# EAGLE design SparkFun NEO-D9S (EAGLE 9.6.2)
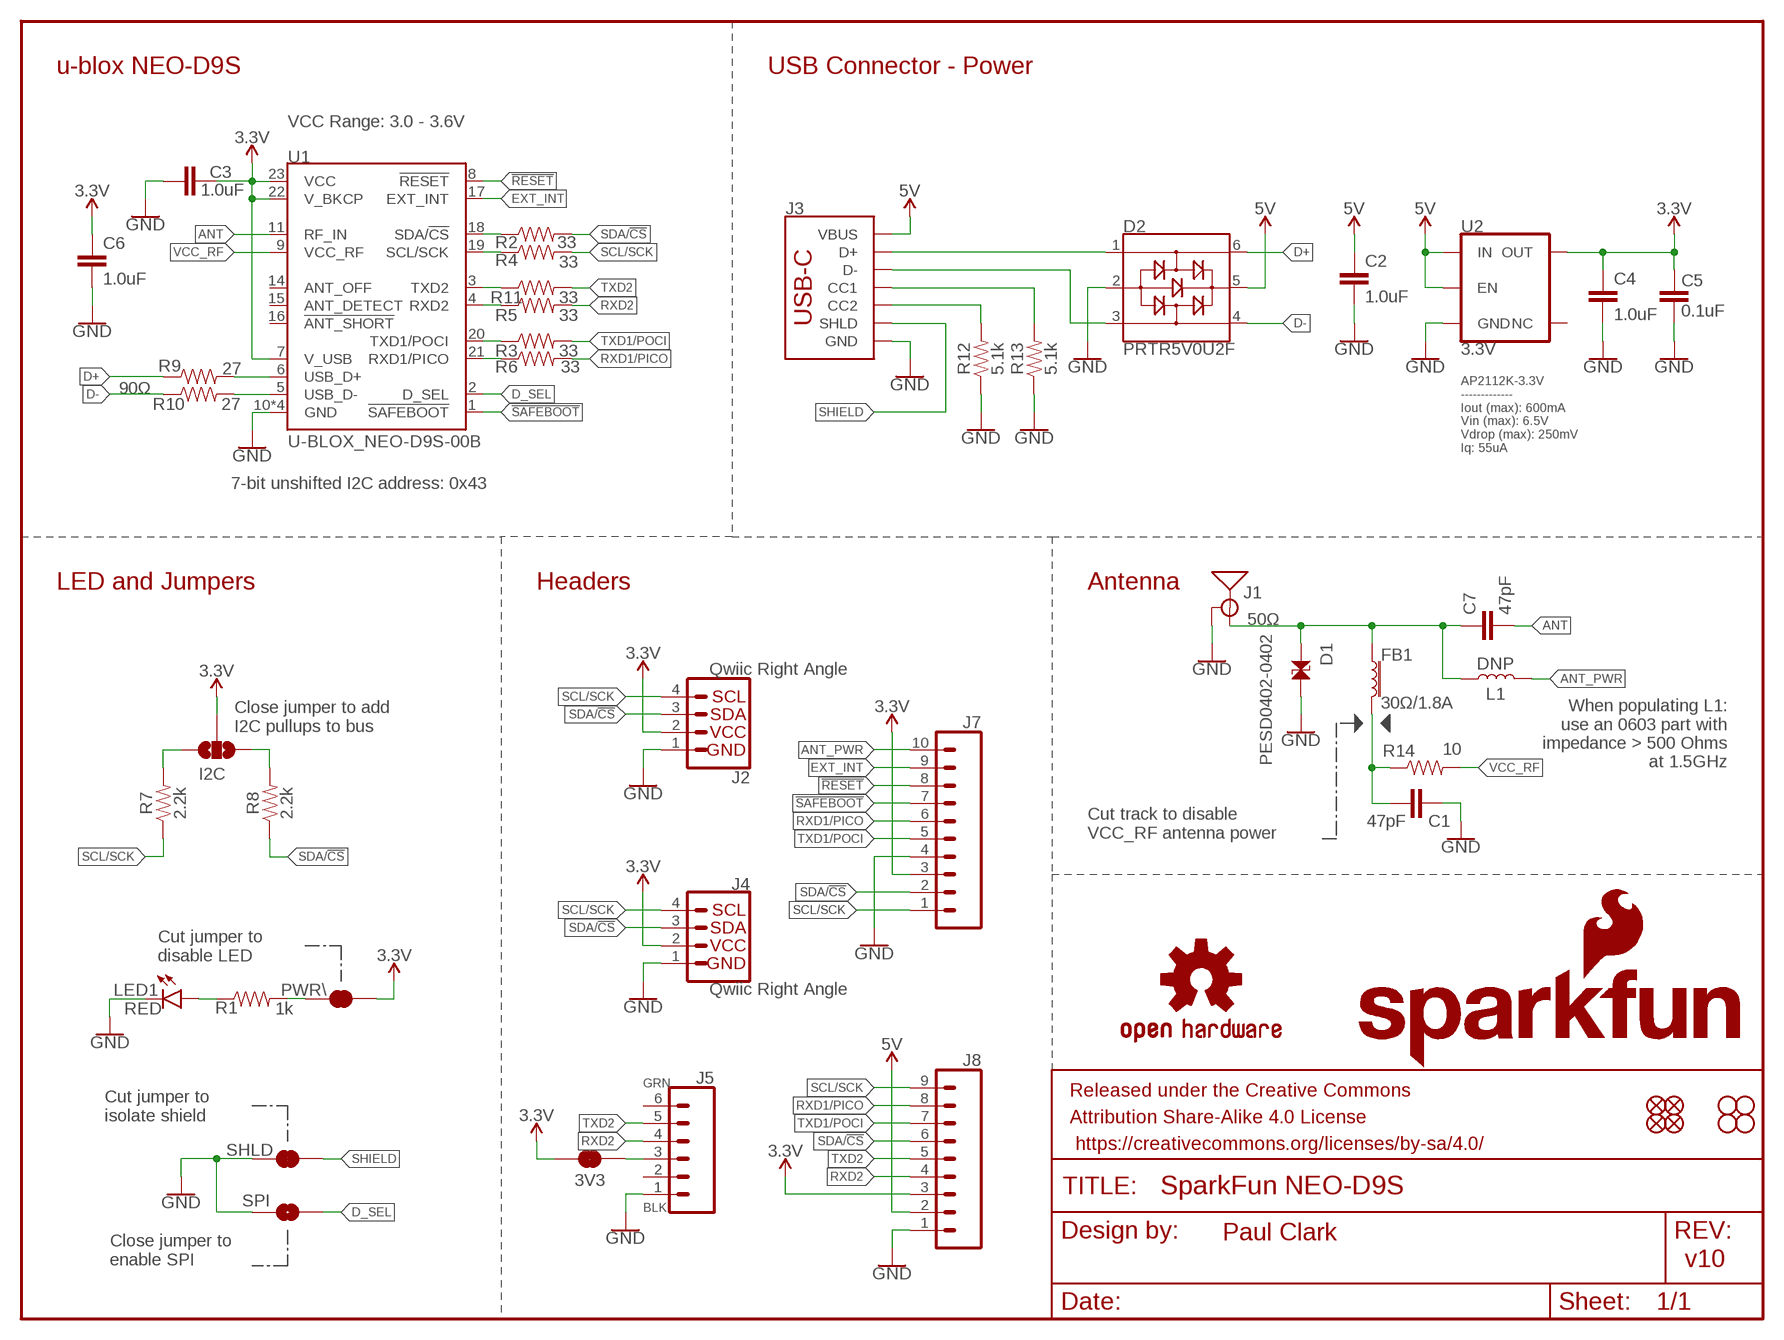
[diagram p0: schematic, sheet 1]

## Parts
3V3  JUMPER-SMT_2_NC_TRACE_SILK  [SMT-JUMPER_2_NC_TRACE_SILK]
C1  47pF  47PF-0603-50V-5%  [0603]
C2  1.0uF  1.0UF-0603-16V-10%  [0603]
C3  1.0uF  1.0UF-0603-16V-10%  [0603]
C4  1.0uF  1.0UF-0603-16V-10%  [0603]
C5  0.1uF  0.1UF-0603-25V-(+80/-20%)  [0603]
C6  1.0uF  1.0UF-0603-16V-10%  [0603]
C7  47pF  47PF-0603-50V-5%  [0603]
D1  PESD0402-0402  [0402]
D2  PRTR5V0U2F  [SOT886]
FB1  30Ω/1.8A  FERRITE_BEAD-0603  [0603]
FRAME1  FRAME-LETTER  [CREATIVE_COMMONS]
I2C  JUMPER-SMT_3_NO_SILK  [SMT-JUMPER_3_NO_SILK]
J1  ANTENNA-SMA-GROUNDEDEDGE_SMA  [SMA-EDGE]
J2  Qwiic Right Angle  I2C_STANDARDQWIIC  [JST04_1MM_RA]
J3  USB_C_2-LAYER_PADS  [USB-C-16P-2LAYER-PADS]
J4  Qwiic Right Angle  I2C_STANDARDQWIIC  [JST04_1MM_RA]
J5  CONN_06NO_SILK_FEMALE_PTH  [1X06_NO_SILK]
J7  CONN_10NO_SILK_PTH_FEMALE  [1X10_NO_SILK]
J8  CONN_09NO_SILK  [1X09_NO_SILK]
JP21  FIDUCIALUFIDUCIAL  [MICRO-FIDUCIAL]
JP31  STAND-OFF  [STAND-OFF]
JP41  STAND-OFF  [STAND-OFF]
JP61  FIDUCIALUFIDUCIAL  [MICRO-FIDUCIAL]
JP71  FIDUCIALUFIDUCIAL  [MICRO-FIDUCIAL]
JP81  FIDUCIALUFIDUCIAL  [MICRO-FIDUCIAL]
JP91  STAND-OFF  [STAND-OFF]
JP101  STAND-OFF  [STAND-OFF]
L1  DNP  DNP-0603_NO-CREAM  [0603_NO-CREAM]
LED1  RED  LED-RED0603  [LED-0603]
LOGO1  OSHW-LOGOS  [OSHW-LOGO-S]
LOGO2  SFE_LOGO_NAME_FLAME.1_INCH  [SFE_LOGO_NAME_FLAME_.1]
LOGO3  SFE_LOGO_NAME_FLAME.1_INCH  [SFE_LOGO_NAME_FLAME_.1]
LOGO4  OSHW-LOGOS  [OSHW-LOGO-S]
PWR\  JUMPER-SMT_2_NC_TRACE_SILK  [SMT-JUMPER_2_NC_TRACE_SILK]
R1  1k  1KOHM-0603-1/10W-1%  [0603]
R2  33  33OHM-0603-1/10W-1%  [0603]
R3  33  33OHM-0603-1/10W-1%  [0603]
R4  33  33OHM-0603-1/10W-1%  [0603]
R5  33  33OHM-0603-1/10W-1%  [0603]
R6  33  33OHM-0603-1/10W-1%  [0603]
R7  2.2k  2.2KOHM-0603-1/10W-1%  [0603]
R8  2.2k  2.2KOHM-0603-1/10W-1%  [0603]
R9  27  27OHM-0603-1/10W-1%  [0603]
R10  27  27OHM-0603-1/10W-1%  [0603]
R11  33  33OHM-0603-1/10W-1%  [0603]
R12  5.1k  5.1KOHM5.1KOHM-0603-1/10W-1%  [0603]
R13  5.1k  5.1KOHM5.1KOHM-0603-1/10W-1%  [0603]
R14  10  10OHM-0603-1/10W-1%  [0603]
SHLD  JUMPER-SMT_2_NC_TRACE_SILK  [SMT-JUMPER_2_NC_TRACE_SILK]
SPI  JUMPER-SMT_2_NO_SILK  [SMT-JUMPER_2_NO_SILK]
U1  U-BLOX_NEO-D9S-00B  [NEO-M9N/M8T/M8U/D9S]
U2  3.3V  V_REG_AP2112K-3.3V  [SOT23-5]

## Nets
3.3V [3.3V]: 3V3.2 C3.1 C4.1 C5.2 C6.1 I2C.2 J2.2 J4.2 J7.3 J8.3 PWR\.2 U1.7(V_USB) U1.22(V_BKCP) U1.23(VCC) U2.5(OUT)
5V: C2.1 D2.5 J3.VBUS1(VBUS) J3.VBUS2(VBUS) J8.2 U2.1(IN) U2.3(EN)
!RESET!: J7.8 U1.8(!RESET!)
!SAFEBOOT!: J7.7 U1.1(!SAFEBOOT!)
ANT: C7.2 U1.11(RF_IN)
ANT_PWR: J7.10 L1.2
ANT_VCC: C1.1 FB1.2 R14.1
D+: D2.6 R9.1
D-: D2.4 R10.1
D_SEL: SPI.2 U1.2(D_SEL)
EXT_INT: J7.9 U1.17(EXT_INT)
GND: C1.2 C2.2 C3.2 C4.2 C5.1 C6.2 D1.2 D2.2 J1.GND@0(GND) J1.GND@1(GND) J1.GND@2(GND) J1.GND@3(GND) J2.1 J3.GND J3.GND2(GND) J4.1 J5.1 J7.4 J8.1 LED1.C R12.1 R13.1 SHLD.1 SPI.1 U1.10(GND) U1.12(GND) U1.13(GND) U1.24(GND) U2.2(GND)
N$1: PWR\.1 R1.2
N$2: R3.1 U1.20(TXD1/POCI)
N$3: R2.1 U1.18(SDA/!CS!)
N$4: R4.1 U1.19(SCL/SCK)
N$5: I2C.1 R8.2
N$6: R6.1 U1.21(RXD1/PICO)
N$7: J3.B5(CC2) R12.2
N$8: I2C.3 R7.2
N$9: J3.A5(CC1) R13.2
N$10: LED1.A R1.1
N$11: R9.2 U1.6(USB_D+)
N$12: R10.2 U1.5(USB_D-)
N$13: 3V3.1 J5.3
N$14: R11.1 U1.3(TXD2)
N$15: R5.1 U1.4(RXD2)
RXD1/PICO: J7.6 J8.8 R6.2
RXD2: J5.4 J8.4 R5.2
SCL/SCK: J2.4 J4.4 J7.1 J8.9 R4.2 R7.1
SDA/!CS!: J2.3 J4.3 J7.2 J8.6 R2.2 R8.1
SHIELD: J3.SHLD1(SHLD) J3.SHLD2(SHLD) J3.SHLD3(SHLD) J3.SHLD4(SHLD) SHLD.2
SMA: C7.1 D1.1 FB1.1 J1.SIG(SIGNAL) L1.1
TXD1/POCI: J7.5 J8.7 R3.2
TXD2: J5.5 J8.5 R11.2
USB_D+: D2.1 J3.A6(D+) J3.B6(D+)
USB_D-: D2.3 J3.A7(D-) J3.B7(D-)
VCC_RF: R14.2 U1.9(VCC_RF)
Unconnected: J5.2 J5.6 U1.14(ANT_OFF) U1.15(ANT_DETECT) U1.16(!ANT_SHORT!) U2.4(NC)

## Notes on the sheet
- u-blox NEO-D9S | USB Connector - Power
- VCC Range: 3.0 - 3.6V
- AP2112K-3.3V
  -------------
  Iout (max): 600mA 
  Vin (max): 6.5V
  Vdrop (max): 250mV
  Iq: 55uA
- 90Ω
- 7-bit unshifted I2C address: 0x43
- LED and Jumpers | Headers | Antenna
- 50Ω
- Close jumper to add
  I2C pullups to bus
- When populating L1:
  use an 0603 part with
  impedance > 500 Ohms
  at 1.5GHz
- Cut track to disable
  VCC_RF antenna power
- Cut jumper to 
  disable LED
- GRN
- Cut jumper to 
  isolate shield
- BLK
- Paul Clark
- Close jumper to
  enable SPI
- v10

## Library data of the parts
3V3 PWR\ SHLD = SparkFun-Jumpers:JUMPER-SMT_2_NC_TRACE: Normally closed trace jumper This jumper has a trace between two pads so it's normally closed (NC). Use a razor knife to open the connection. For best results follow the IPC guidelines for cutting traces: Cutout at least 0.063 mm (0.005 in). Remove all loose material to clean up the cut area. Seal the cut with an approved epoxy. Reapply solder to reclose the connection.
C1 C7 = SparkFun-Capacitors:47PF: 47pF ceramic capacitors A capacitor is a passive two-terminal electrical component used to store electrical energy temporarily in an electric field.; PROD_ID: CAP-08913
C2-C4 C6 = SparkFun-Capacitors:1.0UF: 1µF ceramic capacitors A capacitor is a passive two-terminal electrical component used to store electrical energy temporarily in an electric field.; PROD_ID: CAP-00868
C5 = SparkFun-Capacitors:0.1UF: 0.1µF ceramic capacitors A capacitor is a passive two-terminal electrical component used to store electrical energy temporarily in an electric field.; PROD_ID: CAP-00810
D1 = SparkFun-DiscreteSemi:PESD0402: ESD protection diode PESD is used to protect a signal line from ESD.; DIGIKEY_PART: PESD0402-140CT-ND; MOUSE_PART: 650-PESD0402-140; PROD_ID: DIO-15359
D2 = SparkFun-IC-Power:PRTR5V0U2: A small ESD protection device. Most commonly used on USB D+/D- signals to protect large, expensive, or especially sensitive USB enabled devices.; PROD_ID: DIO-14084
FB1 = SparkFun-Coils:FERRITE_BEAD: Ferrite Bead (blocks, cores, rings, chokes, etc.) Inductor with layers of ferrite used to suppress high frequencies. Often used to isolate high frequency noise. SparkFun Products: IOIO-OTG - V2.2 <https://www.sparkfun.com/products/13613> SparkFun SAMD21 Mini Breakout <https://www.sparkfun.com/products/13664> SparkFun 6 Degrees of Freedom Breakout - LSM6DS3 <https://www.sparkfun.com/products/13339> SparkFun SAMD21 Dev Breakout <https://www.sparkfun.com/products/13672>; PROD_ID: NDUC-13805
FRAME1 = SparkFun-Aesthetics:FRAME-LETTER: Schematic Frame - Letter Standard 8.5x11 US Letter frame
I2C = SparkFun-Jumpers:JUMPER-SMT_3_NO: Normally open jumper This jumper has three pads in close proximity to each other. Apply solder to close the connection(s).
J1 = SparkFun-RF:ANTENNA-SMA-GROUNDED: SMA Antenna Connector w/ Ground Edge-mount and SMD SMA connectors for RF Antennas. **4-LAYER BOARD WARNING!!** When designing a 4-layer board using any of the SMD variants, you will need to manually add a cutout polygon on any internal power layers to make sure that you don't end up with exposed copper around the edge of the routed hole for these connectors. Exposed power copper could then short to the connector body - and that would be bad. Why hasn't anyone added the cutout polygons directly to the connector footprint? Well, your internal layers (usually 2 and 15) may be covered with GND polygons and you might well want the copper to go all the way to the edge, especially under the connector SIGNAL pin. So adding cutouts to the footprint might make matters worse, not better...; PROD_ID: CONN-08289
J2 J4 = SparkFun-Connectors:I2C_STANDARD: SparkFun I2C Standard Pinout Header SparkFun has standardized on a pinout for all I2C based sensor breakouts. This pinout allows I2C boards to be plugged directly into the headers on Arduino Uno compatible boards, and to be daisy chained easily. Example SparkFun Products: SparkFun Atmospheric Sensor Breakout - BME280 <https://www.sparkfun.com/products/13676> SparkFun Altitude/Pressure Sensor Breakout - MPL3115A2 <https://www.sparkfun.com/products/11084> SparkFun TOF Range Finder Sensor - VL6180 <https://www.sparkfun.com/products/12785>; PROD_ID: CONN-13694
J3 = SparkFun-Connectors:USB_C: USB Type C 16Pin Connector Super Speed pins not available on the 16-pin purely SMD connector so this part is best for USB 2.0 implementations. D1 and D2 are tied together enabling D+/- no matter which way the cable is plugged into the connector. The two channel configuration pins (CC1/2) are exposed. These are normally connected to ground via 5.1k resistors but can be reconfigured for high current/high power applications. **4-LAYER BOARD WARNING!!** If designing 4-layer board, make sure to select the variant _4-LAYER-ISOLATED. The linked footprint (USB-C-16-4LAYER-ISOLATED) includes some very necessary cutout polygons in the inner layers (2 and 15). This prevents the PTH mounting shield legs on the USB connector from electrically connecting any other polygons on the inner layers (usually VCC and GND).; PROD_ID: CONN-14122
J5 = SparkFun-Connectors:CONN_06: Multi connection point. Often used as Generic Header-pin footprint for 0.1 inch spaced/style header connections On any of the 0.1 inch spaced packages, you can populate with these: Break Away Headers - Straight <https://www.sparkfun.com/products/116> (PRT-00116) Break Away Male Headers - Right Angle <https://www.sparkfun.com/products/553> (PRT-00553) Female Headers <https://www.sparkfun.com/products/115> (PRT-00115) Break Away Headers - Machine Pin <https://www.sparkfun.com/products/117> (PRT-00117) Break Away Female Headers - Swiss Machine Pin <https://www.sparkfun.com/products/743> (PRT-00743) Arduino Stackable Header - 6 Pin <https://www.sparkfun.com/products/9280> (PRT-09280) For SCREWTERMINALS and SPRING TERMINALS visit here: Screw Terimnals on SparkFun.com <https://www.sparkfun.com/search/results?term=Screw+Terminals> (5mm/3.5mm/2.54mm spacing) This device is also useful as a general connection point to wire up your design to another part of your project. Our various solder wires solder well into these plated through hole pads. Hook-Up Wire - Assortment (Stranded, 22 AWG) <https://www.sparkfun.com/products/11375> (PRT-11375) Hook-Up Wire - Assortment (Solid Core, 22 AWG) <https://www.sparkfun.com/products/11367> (PRT-11367) View the entire wire category on our website here <https://www.sparkfun.com/categories/141>; PROD_ID: CONN-08437
J7 = SparkFun-Connectors:CONN_10: Multi connection point. Often used as Generic Header-pin footprint for 0.1 inch spaced/style header connections On any of the 0.1 inch spaced packages, you can populate with these: Break Away Headers - Straight <https://www.sparkfun.com/products/116> (PRT-00116) Break Away Male Headers - Right Angle <https://www.sparkfun.com/products/553> (PRT-00553) Female Headers <https://www.sparkfun.com/products/115> (PRT-00115) Break Away Headers - Machine Pin <https://www.sparkfun.com/products/117> (PRT-00117) Break Away Female Headers - Swiss Machine Pin <https://www.sparkfun.com/products/743> (PRT-00743) Arduino Stackable Header - 10 Pin <https://www.sparkfun.com/products/11376> (PRT-11376) For SCREWTERMINALS and SPRING TERMINALS visit here: Screw Terimnals on SparkFun.com <https://www.sparkfun.com/search/results?term=Screw+Terminals> (5mm/3.5mm/2.54mm spacing) This device is also useful as a general connection point to wire up your design to another part of your project. Our various solder wires solder well into these plated through hole pads. Hook-Up Wire - Assortment (Stranded, 22 AWG) <https://www.sparkfun.com/products/11375> (PRT-11375) Hook-Up Wire - Assortment (Solid Core, 22 AWG) <https://www.sparkfun.com/products/11367> (PRT-11367) View the entire wire category on our website here <https://www.sparkfun.com/categories/141> Special notes: Molex polarized connector foot print use with SKU : PRT-08231 with associated crimp pins and housings. 1MM SMD Version SKU: PRT-10208 NOTES ON THE VARIANTS LOCK and LOCK_LONGPADS... This footprint was designed to help hold the alignment of a through-hole component (i.e. 6-pin header) while soldering it into place. You may notice that each hole has been shifted either up or down by 0.005 of an inch from it's more standard position (which is a perfectly straight line). This slight alteration caused the pins (the squares in the middle) to touch the edges of the holes. Because they are alternating, it causes a "brace" to hold the component in place. 0.005 has proven to be the perfect amount of "off-center" position when using our standard breakaway headers. Although looks a little odd when you look at the bare footprint, once you have a header in there, the alteration is very hard to notice. Also,if you push a header all the way into place, it is covered up entirely on the bottom side.
J8 = SparkFun-Connectors:CONN_09: Multi connection point. Often used as Generic Header-pin footprint for 0.1 inch spaced/style header connections On any of the 0.1 inch spaced packages, you can populate with these: Break Away Headers - Straight <https://www.sparkfun.com/products/116> (PRT-00116) Break Away Male Headers - Right Angle <https://www.sparkfun.com/products/553> (PRT-00553) Female Headers <https://www.sparkfun.com/products/115> (PRT-00115) Break Away Headers - Machine Pin <https://www.sparkfun.com/products/117> (PRT-00117) Break Away Female Headers - Swiss Machine Pin <https://www.sparkfun.com/products/743> (PRT-00743) For SCREWTERMINALS and SPRING TERMINALS visit here: Screw Terimnals on SparkFun.com <https://www.sparkfun.com/search/results?term=Screw+Terminals> (5mm/3.5mm/2.54mm spacing) This device is also useful as a general connection point to wire up your design to another part of your project. Our various solder wires solder well into these plated through hole pads. Hook-Up Wire - Assortment (Stranded, 22 AWG) <https://www.sparkfun.com/products/11375> (PRT-11375) Hook-Up Wire - Assortment (Solid Core, 22 AWG) <https://www.sparkfun.com/products/11367> (PRT-11367) View the entire wire category on our website here <https://www.sparkfun.com/categories/141> Special notes: Molex polarized connector foot print use with SKU : PRT-08231 with associated crimp pins and housings. 1MM SMD Version SKU: PRT-10208 NOTES ON THE VARIANTS LOCK and LOCK_LONGPADS... This footprint was designed to help hold the alignment of a through-hole component (i.e. 6-pin header) while soldering it into place. You may notice that each hole has been shifted either up or down by 0.005 of an inch from it's more standard position (which is a perfectly straight line). This slight alteration caused the pins (the squares in the middle) to touch the edges of the holes. Because they are alternating, it causes a "brace" to hold the component in place. 0.005 has proven to be the perfect amount of "off-center" position when using our standard breakaway headers. Although looks a little odd when you look at the bare footprint, once you have a header in there, the alteration is very hard to notice. Also,if you push a header all the way into place, it is covered up entirely on the bottom side.
JP21 JP61 JP71 JP81 = SparkFun:FIDUCIAL: Fiducial Alignment Points Various fiducial points for machine vision alignment.
JP31 JP41 JP91 JP101 = SparkFun:STAND-OFF: Stand Off This is the mechanical footprint for a #4 phillips button head screw. Use the keepout ring to avoid running the screw head into surrounding components. SKU : PRT-00447
L1 = SparkFun-Coils:DNP
LED1 = SparkFun-LED:LED-RED: Red SMD LED Used in manufacturing of most products at SparkFun Packages: 0603 - SMD 0603 package [Product Link] <http://docs.avagotech.com/docs/AV02-0551EN> 0603 SMART - SMD 0603 SMART package ( more efficient and expensive)[Product Link] <http://www.osram-os.com/Graphics/XPic2/00077099_0.pdf> 1206 - SMD1206 package [Product Link] <https://www.sparkfun.com/datasheets/DevTools/LilyPad/Q150OVS4.pdff> SparkFun Products: Pro Mini 328 -5V <https://www.sparkfun.com/products/821> RedBoard <https://www.sparkfun.com/products/12757> IOIO-OTG <https://www.sparkfun.com/products/13613>; PROD_ID: DIO-00819
LOGO1 LOGO4 = SparkFun-Aesthetics:OSHW-LOGO: Open-Source Hardware (OSHW) Logo This logo indicates the piece of hardware it is found on incorporates a OSHW license and/or adheres to the definition of open source hardware found here: http://freedomdefined.org/OSHW
LOGO2 LOGO3 = SparkFun-Aesthetics:SFE_LOGO_NAME_FLAME: SparkFun Font Logo w/ Flame This is the SparkFun full logo. The logo on the schematic will always be the same size; the package variant is the height of the flame part of the logo. Default layer for the logo on the board is tSilk.
R1 = SparkFun-Resistors:1KOHM: 1kΩ resistor A resistor is a passive two-terminal electrical component that implements electrical resistance as a circuit element. Resistors act to reduce current flow, and, at the same time, act to lower voltage levels within circuits. - Wikipedia; PROD_ID: RES-07856
R2-R6 R11 = SparkFun-Resistors:33OHM: 33Ω resistor A resistor is a passive two-terminal electrical component that implements electrical resistance as a circuit element. Resistors act to reduce current flow, and, at the same time, act to lower voltage levels within circuits. - Wikipedia; PROD_ID: RES-08270
R7 R8 = SparkFun-Resistors:2.2KOHM: 2.2kΩ resistor A resistor is a passive two-terminal electrical component that implements electrical resistance as a circuit element. Resistors act to reduce current flow, and, at the same time, act to lower voltage levels within circuits. - Wikipedia; PROD_ID: RES-08272
R9 R10 = SparkFun-Resistors:27OHM: 27Ω resistor A resistor is a passive two-terminal electrical component that implements electrical resistance as a circuit element. Resistors act to reduce current flow, and, at the same time, act to lower voltage levels within circuits. - Wikipedia; PROD_ID: RES-09334
R12 R13 = SparkFun-Resistors:5.1KOHM; PROD_ID: RES-12083
R14 = SparkFun-Resistors:10OHM: 10Ω resistor A resistor is a passive two-terminal electrical component that implements electrical resistance as a circuit element. Resistors act to reduce current flow, and, at the same time, act to lower voltage levels within circuits. - Wikipedia; PROD_ID: RES-12581
SPI = SparkFun-Jumpers:JUMPER-SMT_2_NO: Normally open jumper This jumper has two pads in close proximity to each other. Apply solder to close the connection. Round pads are easier to solder for beginners, but are a lot larger. SparkFun Product that uses the round pads: SparkFun EL Sequencer <https://www.sparkfun.com/products/12781>
U1 = SparkFun-GPS:U-BLOX_NEO-D9S: u-blox NEO-D9S The NEO-D9S can receive the data stream of a GNSS correction service, broadcast via satellite L band and compliant to the specification the product is designed for. Integrated with a high precision GNSS receiver, such as from the u-blox F9 platform, it enables the positioning system to reach down to centimeter-level accuracy.; PROD_ID: IC-16579
U2 = SparkFun-IC-Power:V_REG_AP2112: AP2112 - 600mA CMOS LDO Regulator w/ Enable The AP2112 is CMOS process low dropout linear regulator with enable function, the regulator delivers a guaranteed 600mA (min.) continuous load current. Features Output Voltage Accuracy: ±1.5% Output Current: 600mA (Min.) Foldback Short Current Protection: 50mA Enable Function to Turn ON/OFF VOUT Low Dropout Voltage (3.3V): 250mV (Typ.) @IOUT=600mA Excellent Load Regulation: 0.2%/A (Typ.) Excellent Line Regulation: 0.02%/V (Typ.) Low Quiescent Current: 55μA (Typ.) Low Standby Current: 0.01μA (Typ.) Low Output Noise: 50μVRMS PSRR: 100Hz -65dB, 1kHz -65dB OTSD Protection Stable with 1.0μF Flexible Cap: Ceramic, Tantalum and Aluminum Electrolytic Operation Temperature Range: -40°C to 85°C ESD: MM 400V, HBM 4000V; PROD_ID: VREG-12457

## Net classes
1 vcc: width 0.152 mm
2 3.3V: width 0.508 mm

## Board
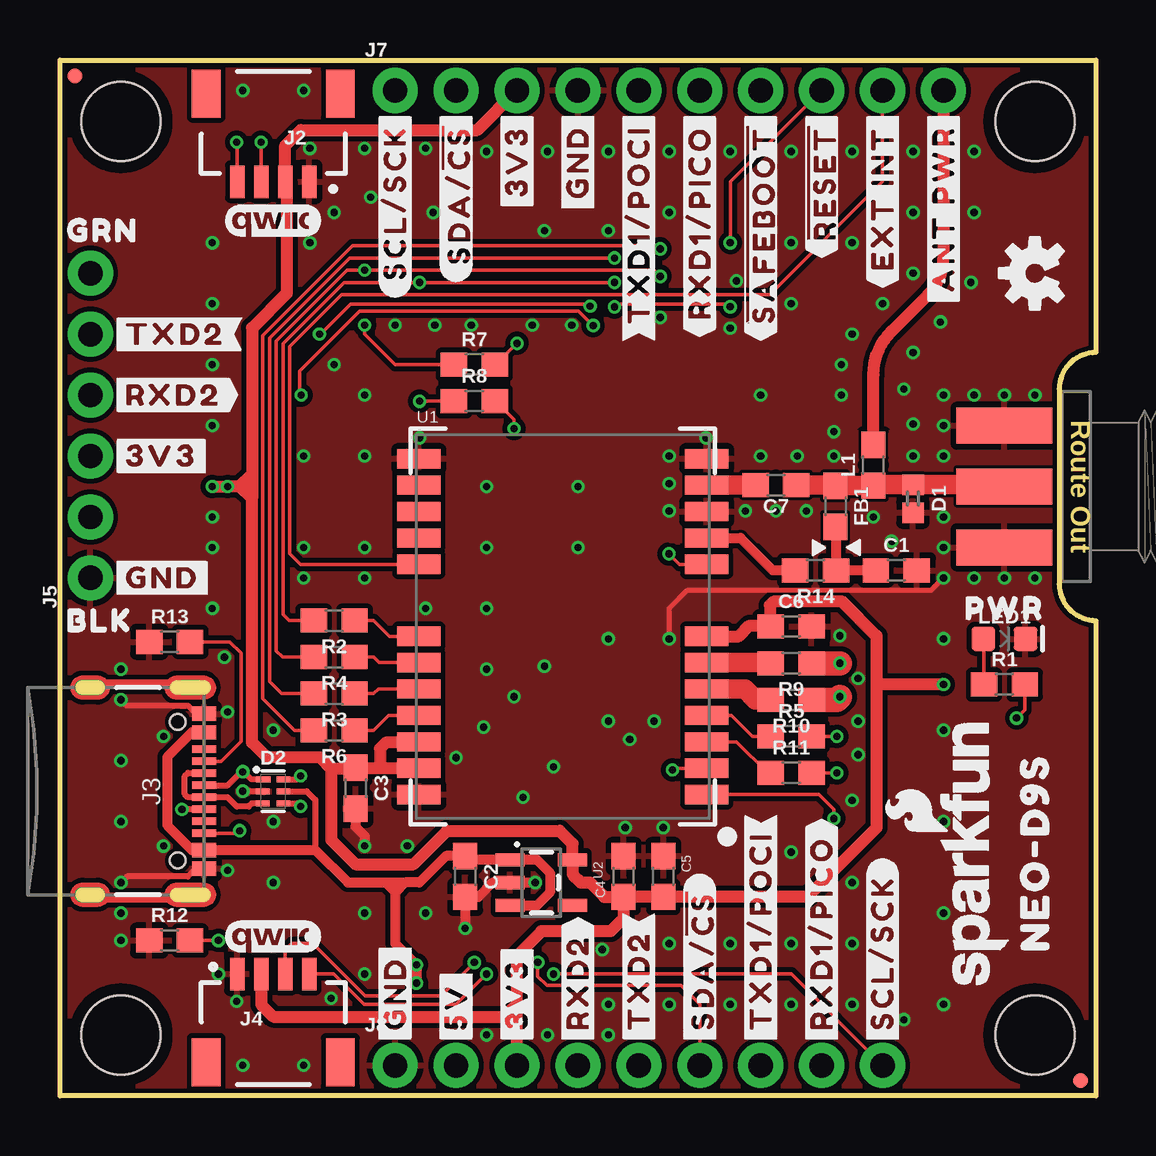
[diagram p1: board, top side]
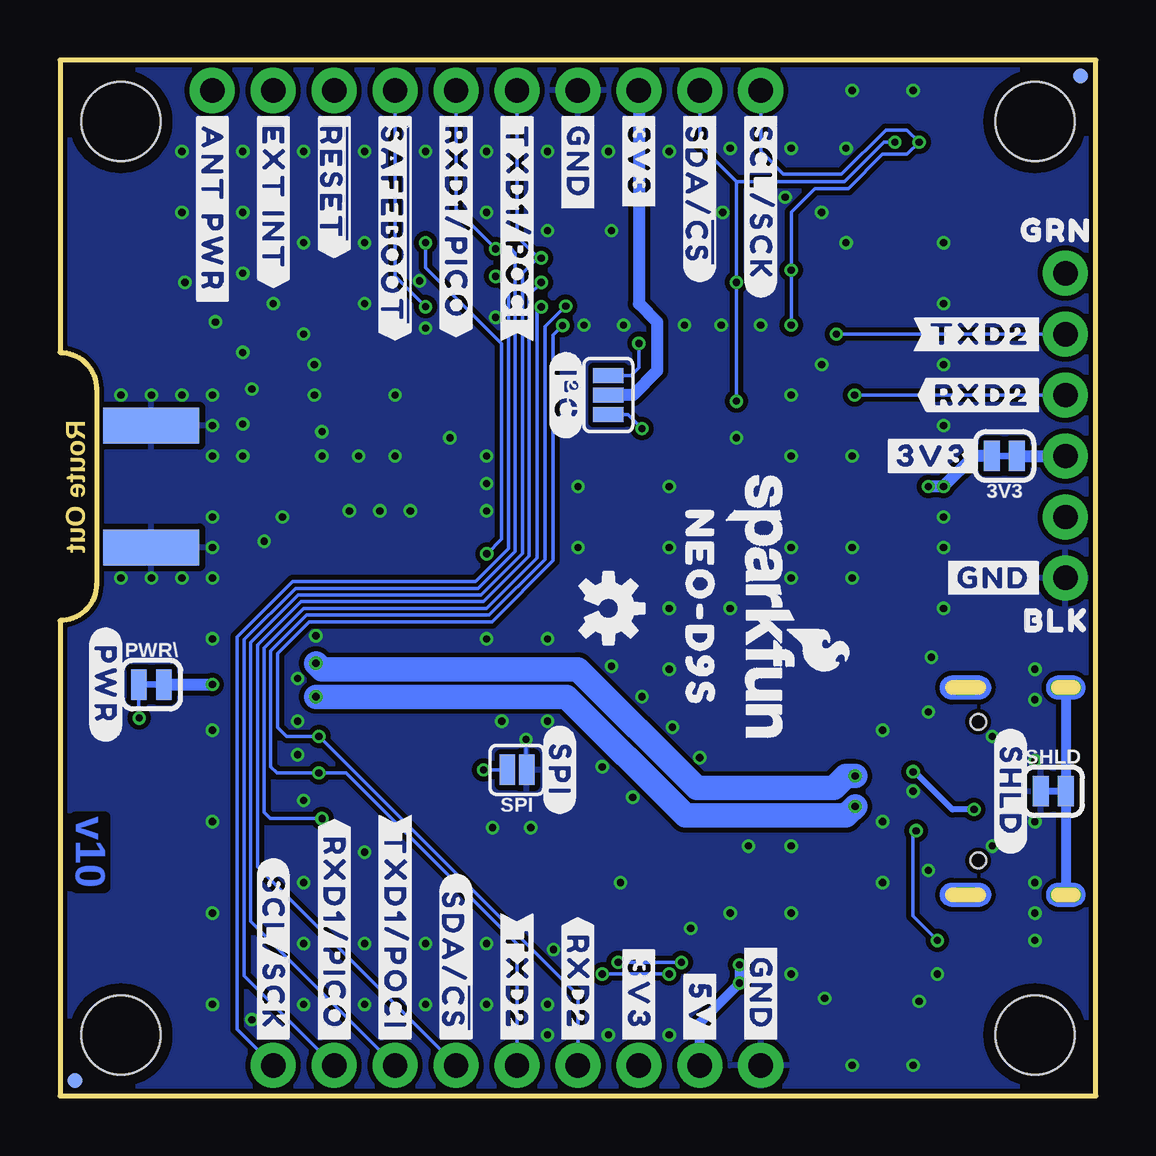
[diagram p2: board, bottom side, seen from below]

Size 43.18 x 43.18 mm. Coordinates in mm from the lower left corner, seen from the top.
Outline: 0,0 0,43.18 43.18,43.18 43.18,30.99 arc90 41.66,29.46 41.66,21.34 arc90 43.18,19.81 43.18,0 0,0
Copper layers (1*16): Top 0.035mm / dielectric 1.5mm / Bottom 0.035mm
Design rules "SparkFun-2-Layer-Minimum-JLCPCB": minimum track width 5mil, minimum drill 0.3mm, track to track 5mil, track to pad 5mil, pad to pad 5mil, via to via 5mil, smd to smd 5mil, copper to edge 7mil, drill to drill 7mil, minimum pad ring 5mil, minimum via ring 5mil, stop-mask expansion 2.5mil, vias tented up to drill 25mil, thermal gap 10mil
tRestrict: 2 lines

### Footprints (pad centres in the part's own frame; a part is rotated, then mirrored left to right if it is on the bottom)
SMT-JUMPER_2_NC_TRACE_SILK = smd 0.66 x 1.27: 1 -0.521,0; 2 0.521,0
0603 = smd 1.1 x 1: 1 -0.85,0; 2 0.85,0
0402 = smd 0.85 x 0.9: 1 -0.58,0; 2 0.58,0
SOT886 = smd 0.61 x 0.25: 1 -0.405,0.5 | smd 0.56 x 0.25: 2 -0.43,0; 3 -0.43,-0.5; 4 0.43,-0.5; 5 0.43,0; 6 0.43,0.5
SMT-JUMPER_3_NO_SILK = smd 0.635 x 1.27: 1 -0.813,0; 2 0,0; 3 0.813,0
SMA-EDGE = smd 1.5 x 4: GND@0 -2.54,0; GND@1 2.54,0; SIG 0,0 | smd 1.5 x 4 bottom: GND@2 -2.54,0; GND@3 2.54,0
JST04_1MM_RA = smd 0.6 x 1.35: 1 -1.5,0; 2 -0.5,0; 3 0.5,0; 4 1.5,0 | smd 1.2 x 2: NC1 2.8,-3.675; NC2 -2.8,-3.675
USB-C-16P-2LAYER-PADS = smd 0.3 x 1: A5 -1.25,-0.34; A6 -0.25,-0.34; A7 0.25,-0.34; A8 1.25,-0.34; B5 1.75,-0.34; B6 0.75,-0.34; B7 -0.75,-0.34; B8 -1.75,-0.34 | smd 0.6 x 1: GND -3.225,-0.34; GND2 3.225,-0.34; VBUS1 -2.45,-0.34; VBUS2 2.45,-0.34 | drill 0.4 pad 0.6 long: SHLD1 -4.318,-0.915; SHLD2 4.318,-0.915; SHLD3 -4.318,-5.095; SHLD4 4.318,-5.095 | hole 0.65: -2.89,-1.445; 2.89,-1.445
1X06_NO_SILK = drill 1.016 pad 1.88: 1 0,0; 2 2.54,0; 3 5.08,0; 4 7.62,0; 5 10.16,0; 6 12.7,0
1X10_NO_SILK = drill 1.016 pad 1.88: 1 0,0; 2 2.54,0; 3 5.08,0; 4 7.62,0; 5 10.16,0; 6 12.7,0; 7 15.24,0; 8 17.78,0; 9 20.32,0; 10 22.86,0
1X09_NO_SILK = drill 1.016 pad 1.88: 1 0,0; 2 2.54,0; 3 5.08,0; 4 7.62,0; 5 10.16,0; 6 12.7,0; 7 15.24,0; 8 17.78,0; 9 20.32,0
MICRO-FIDUCIAL = smd 0.635 x 0.635: 1 0,0
STAND-OFF = hole 3.302: 0,0
0603_NO-CREAM = smd 1.1 x 1: 1 -0.85,0; 2 0.85,0
LED-0603 = smd 1 x 1: A -0.877,0; C 0.877,0
SMT-JUMPER_2_NO_SILK = smd 0.635 x 1.27: 1 -0.406,0; 2 0.406,0
NEO-M9N/M8T/M8U/D9S = smd 1.8 x 0.8: 1 6,-7; 2 6,-5.9; 3 6,-4.8; 4 6,-3.7; 5 6,-2.6; 6 6,-1.5; 7 6,-0.4; 8 6,2.6; 9 6,3.7; 10 6,4.8; 11 6,5.9; 12 6,7; 13 -6,7; 14 -6,5.9; 15 -6,4.8; 16 -6,3.7; 17 -6,2.6; 18 -6,-0.4; 19 -6,-1.5; 20 -6,-2.6; 21 -6,-3.7; 22 -6,-4.8; 23 -6,-5.9; 24 -6,-7
SOT23-5 = smd 0.55 x 1.2: 1 -0.95,-1.3; 2 0,-1.3; 3 0.95,-1.3; 4 0.95,1.3; 5 -0.95,1.3

### Placement (x,y rotation side)
3V3  3.81,26.67 180 bottom
C1  34.86,21.91 0 top
C2  16.89,9.14 270 top
C3  12.32,12.83 270 top
C4  23.5,9.14 90 top
C5  25.15,9.14 270 top
C6  30.48,19.56 0 top
C7  29.84,25.46 180 top
D1  35.56,24.89 270 top
D2  8.89,12.7 0 top
FB1  32.32,24.57 270 top
FRAME1  -7.62,-17.78 0 top  (outside the outline)
I2C  20.32,29.21 90 bottom
J1  39.37,25.4 270 top
J2  8.89,38.1 180 top
J3  6.35,12.7 270 top
J4  8.89,5.08 0 top
J5  1.27,21.59 90 top
J7  13.97,41.91 0 top
J8  13.97,1.27 0 top
JP21  42.55,0.64 0 top
JP31  2.54,40.61 0 top
JP41  40.64,40.61 0 top
JP61  0.64,42.52 0 top
JP71  42.55,0.64 0 bottom
JP81  0.64,42.52 0 bottom
JP91  2.54,2.54 0 top
JP101  40.64,2.54 0 top
L1  33.91,26.29 90 top
LED1  39.37,19.05 0 top
LOGO1  40.64,34.29 90 top
LOGO2  13.97,20.32 270 bottom
LOGO3  38.1,10.16 90 top
LOGO4  20.32,20.32 270 bottom
PWR\  39.37,17.14 0 bottom
R1  39.37,17.14 0 top
R2  11.43,19.81 180 top
R3  11.43,16.76 180 top
R4  11.43,18.29 180 top
R5  30.48,14.99 0 top
R6  11.43,15.24 180 top
R7  17.27,30.48 0 top
R8  17.27,28.96 0 top
R9  30.48,18.03 180 top
R10  30.48,16.51 180 top
R11  30.48,13.46 0 top
R12  4.57,6.48 0 top
R13  4.57,18.92 0 top
R14  31.5,21.91 180 top
SHLD  1.78,12.7 0 bottom
SPI  24.13,13.59 180 bottom
U1  20.95,19.56 0 top
U2  20.07,8.89 270 top
U$1  [#GND#0]  13.97,2.03 90 top
U$2  [#GND#0]  2.03,21.59 0 top
U$3  [#GND#0]  21.59,41.15 270 bottom
U$4  [#GND#1]  21.59,41.15 90 top
U$5  [#GND#1]  2.03,21.59 0 bottom
U$6  [#GND#1]  13.97,2.03 270 bottom
U$7  [#TXD2#0]  2.03,31.75 0 top
U$8  [#TXD2#0]  24.13,2.03 90 top
U$9  [#TXD2#3]  24.13,2.03 270 bottom
U$10  [#TXD2#3]  2.03,31.75 0 bottom
U$11  [#RXD2#0]  21.59,2.03 90 top
U$12  [#RXD2#0]  2.03,29.21 0 top
U$13  [#RXD2#3]  2.03,29.21 0 bottom
U$14  [QWIIC_4MM]  8.89,6.63 0 top
U$15  [#RXD2#3]  21.59,2.03 270 bottom
U$16  [BLK0]  1.65,19.81 0 top
U$17  [BLK0]  1.65,19.81 0 bottom
U$18  [GRN0]  1.78,36.07 0 top
U$19  [GRN0]  1.65,36.07 0 bottom
U$20  [#5V#0]  16.51,2.03 90 top
U$21  [#5V#6]  16.51,2.03 270 bottom
U$22  [#3V3#0]  19.05,2.03 90 top
U$23  [#3V3#0]  19.05,41.15 270 bottom
U$24  [#3V3#4]  19.05,2.03 270 bottom
U$25  [#3V3#4]  19.05,41.15 90 top
U$26  [#SDA##CS##0]  26.67,2.03 90 top
U$27  [#SDA##CS##0]  16.51,41.15 270 bottom
U$28  [#SDA##CS##1]  26.67,2.03 270 bottom
U$29  [#SDA##CS##1]  16.51,41.15 90 top
U$30  [#TXD1#POCI#0]  29.21,2.03 90 top
U$31  [#TXD1#POCI#0]  24.13,41.15 270 bottom
U$32  [#TXD1#POCI#2]  24.13,41.15 90 top
U$33  [#TXD1#POCI#2]  29.21,2.03 270 bottom
U$34  [#RXD1#PICO#0]  31.75,2.03 90 top
U$35  [#RXD1#PICO#0]  26.67,41.15 270 bottom
U$36  [#RXD1#PICO#2]  26.67,41.15 90 top
U$37  [#RXD1#PICO#2]  31.75,2.03 270 bottom
U$38  [QWIIC_4MM]  8.89,36.47 0 top
U$39  [#SCL#SCK#0]  34.29,2.03 90 top
U$40  [#SCL#SCK#0]  13.97,41.15 270 bottom
U$41  [#SCL#SCK#1]  13.97,41.15 90 top
U$42  [#SCL#SCK#1]  34.29,2.03 270 bottom
U$43  [##SAFEBOOT##0]  29.21,41.15 90 top
U$44  [##SAFEBOOT##1]  29.21,41.15 270 bottom
U$45  [##RESET##0]  31.75,41.15 90 top
U$46  [##RESET##1]  31.75,41.15 270 bottom
U$47  [#EXT_INT#0]  34.29,41.15 90 top
U$48  [#EXT_INT#1]  34.29,41.15 270 bottom
U$49  [PWR0]  39.37,20.32 0 top
U$50  [#PWR#0]  41.27,17.14 270 bottom
U$51  [#SPI#0]  22.35,13.59 270 bottom
U$52  [#I�C#0]  22.1,29.21 270 bottom
U$53  [#SHLD#0]  3.56,12.7 270 bottom
U$54  [NEO#D9S0]  40.64,10.16 90 top
U$55  [NEO#D9S0]  16.51,20.32 270 bottom
U$56  [#3V3#0]  2.03,26.67 0 top
U$57  [#3V3#0]  9.02,26.67 0 bottom
U$58  [#ANT_PWR#0]  36.83,41.15 90 top
U$59  [#ANT_PWR#1]  36.83,41.15 270 bottom

### Tracks (layer width: path | path; a pad name or v marks a point on that pad's centre or on a via)
3.3V  (via drill 0.3)
  Top 0.508: 11.3,13.63 11.3,10.67 12.32,9.65 14.73,9.65 16.13,11.05 20.83,11.05 21.37,10.51 U2.5 21.37,9.24 21.72,8.89 22.1,8.89 22.69,8.29 C4.1 | C4.1 C5.2 31.15,8.29 34.04,11.18 34.04,17.14 | J4.2 8.39,3.8 8.89,3.3 18.54,3.3 | 34.04,17.14 34.04,19.18 32.62,20.6 29.74,20.6 29.59,20.45 29.59,19.6 | C4.1 23.5,7.41 22.95,6.86 20.07,6.86 19.05,5.84 19.05,3.81 | 29.59,19.6 C6.1 | 29.59,19.6 28.74,19.6 28.3,19.16 U1.7 | U1.23 13.34,13.66 | 11.3,13.63 10.81,14.12 8.61,14.12 8,14.73 8,24.89 | U1.22 14.93,14.73 13.59,14.73 13.34,14.48 13.34,13.66 | 13.34,13.66 13.32,13.68 C3.1 12.27,13.63 11.3,13.63 | v6.35,25.4 v6.99,25.4 7.49,25.4 | v36.83,17.14 34.04,17.14 | 8,24.89 7.49,25.4 | 8,25.91 7.49,25.4 | 8,25.91 8,32.01 9.45,33.46 9.45,38.04 J2.2 9.39,39.62 10.03,40.26 17.4,40.26 J7.3 | 8,25.91 8,24.89 | 18.54,3.3 19.05,3.81 | 18.54,3.3 19.05,2.79 | J8.3 19.05,2.79 | 19.05,2.79 19.05,3.81
  Bottom 0.508: 3V3.2 5.09,26.67 6.35,25.41 v6.35,25.4 v6.99,25.4 | PWR\.2 v36.83,17.14 | I2C.2 19.3,29.21 18.29,30.23 18.29,32.26 19.05,33.02 J7.3
5V  (via drill 0.3)
  Top 0.254: D2.5 10.29,12.7 10.64,12.35 10.64,10.25
  Top 0.406: J3.VBUS1 5.5,15.15 4.47,14.12 4.47,11.28 5.5,10.25 J3.VBUS2 10.64,10.25 12,8.89 13.58,8.89 | U2.3 19.88,7.94 20.45,8.51 20.45,9.27 19.88,9.84 U2.1 17.05,9.84 C2.1 16.09,9.99 14.99,8.89 14.39,8.89 | v14.86,4.7 v14.86,5.46 13.97,6.35 13.97,8.47 | 13.97,8.47 13.97,8.5 13.58,8.89 | 14.39,8.89 13.97,8.47 | 13.58,8.89 14.39,8.89
  Bottom 0.406: J8.2 16.51,3.05 v14.86,4.7 v14.86,5.46
!RESET!  (via drill 0.3)
  Top 0.152: v25.39,22.59 25.82,22.16 U1.8 | v27.94,35.56 27.94,38.1 J7.8
  Bottom 0.152: v25.39,22.59 24.77,23.21 24.77,31.36 27.94,34.53 v27.94,35.56
!SAFEBOOT!  (via drill 0.3)
  Top 0.152: v32.26,11.56 32.26,11.94 31.64,12.56 U1.1 | v27.94,32.89 27.82,33.01 23.24,33.01 v23.11,32.88
  Bottom 0.152: v32.26,11.56 34.42,11.56 34.67,11.81 34.67,18.67 33.02,20.32 25.4,20.32 23.3,22.42 23.3,32.7 v23.11,32.88 | J7.7 29.21,34.16 v27.94,32.89
ANT
  Top 0.813: U1.11 C7.2
ANT_PWR
  Top 0.508: J7.10 36.83,34.93 arc-45 36.2,33.4 34.65,31.86 arc45 33.91,30.06 L1.2
ANT_VCC
  Top 0.406: FB1.2 32.35,23.7 R14.1 C1.1
D+  (via drill 0.3)
  Top 0.254: D2.6 9.9,13.2 v10.03,13.34
  Top 1.016: v32.51,18.03 R9.1
  Bottom 1.016: v32.51,18.03 32.26,17.78 21.59,17.78 16.64,12.83 10.92,12.83 10.41,13.34 v10.03,13.34
D-  (via drill 0.3)
  Top 0.254: D2.4 9.9,12.2 v10.03,12.06
  Top 1.016: v32.51,16.64 32.38,16.51 R10.1
  Bottom 1.016: v10.03,12.06 10.41,11.68 17.11,11.68 22.06,16.64 v32.51,16.64
D_SEL  (via drill 0.3)
  Top 0.152: v25.53,13.59 25.6,13.66 U1.2
  Bottom 0.152: v25.53,13.59 SPI.2
EXT_INT
  Top 0.152: J7.9 34.29,38.1 29.59,33.4 11.74,33.4 9.58,31.24 9.58,22.61 10.02,22.16 U1.17
GND  (via drill 0.3)
  Top 0.203: v25.4,19.05 25.4,20.32 26.16,21.08 36.32,21.08 v36.83,21.59
  Top 0.254: D2.2 v7.62,12.7 | J3.GND 5.67,15.93 5.33,16.26 2.79,16.26 v2.54,16.51 | J3.GND2 5.67,9.47 5.33,9.14 2.79,9.14 v2.54,8.89
  Top 0.406: C3.2 12.32,11.21 12.7,10.83 v12.7,10.41 | v16.89,6.99 C2.2 17.44,8.29 18.03,8.89 U2.2 v19.81,8.89
  Bottom 0.152: v23.75,14.86 23.75,13.61 SPI.1
  other vias: 14.99,27.43 26.92,27.43 25.4,24.38 28.57,24.38 32.26,27.69 29.84,24.38 31.11,24.38 33.91,24.13 36.83,24.13 36.83,22.86 38.1,21.59 39.37,21.59 40.64,21.59 25.4,26.67 25.4,25.53 29.21,26.67 30.73,26.67 32.26,26.67 34.67,23.11 35.56,26.67 35.56,28 36.83,26.67 36.83,27.94 36.83,29.21 38.1,29.21 39.37,29.21 40.64,29.21 10.41,35.56 10.41,39.5 6.99,16 6.99,9.4 2.54,6.48 23.56,11.18 25.15,11.18 17.65,15.37 18.92,16.64 20.19,17.91 22.86,19.05 19.3,12.45 20.57,13.72 22.86,15.62 24.77,15.62 32.51,19.18 33.27,17.4 33.27,15.62 7.37,3.94 6.6,5.08 2.54,11.43 2.54,13.97 4.32,14.99 4.32,10.41 17.78,2.54 20.32,2.54 7.62,1.27 11.3,4.06 12.7,5.08 12.7,7.62 15.24,7.62 8.89,8.89 8.89,11.43 8.89,15.24 12.7,39.5 15.24,39.5 11.43,36.83 15.56,36.83 22.86,39.37 22.86,36.07 27.94,39.37 28.19,33.97 27.94,32 30.48,35.56 35.56,39.37 2.54,17.78 2.54,7.62 35.56,36.83 33.02,35.56 21.59,25.4 21.59,22.86 17.78,25.4 17.78,22.86 17.78,20.32 17.78,17.78 10.16,21.59 12.7,21.59 15.24,20.32 10.16,22.86 12.7,22.86 6.35,22.86 6.35,20.32 12.7,26.67 10.16,26.67 11.43,30.48 12.7,29.21 15.62,32.13 17.14,32.13 6.35,27.94 6.35,30.48 6.35,35.56 10.16,41.91 7.62,41.91 21.34,32.13 20.19,36.07 36.83,19.05 36.83,15.24 36.83,11.43 36.83,7.62 36.83,3.81 33.02,3.81 30.48,3.81 27.94,3.81 25.4,3.81 22.86,3.81 22.86,2.54 25.4,6.35 27.94,6.35 30.48,10.16 22.61,6.1 33.02,8.89 33.02,12.32 6.86,18.29 6.35,33.02 30.48,6.35 33.02,39.37 30.48,33.02 33.02,6.35 10.16,1.27 35.18,3.17 17.78,39.37 20.32,39.37 25.4,39.37 25.4,36.83 30.48,39.37 33.27,14.22 29.21,29.21 14.48,10.41 16.51,14.1 6.35,24.13 35.56,34.29 34.29,33.02 33.02,31.75 32.58,30.48 35.18,29.46 36.7,32.26 38.1,39.37 38.1,36.83 37.97,33.91 32.58,29.21 35.56,30.99 25.02,32.45 13.97,32.13 12.95,37.47 19.68,32.13
  pour Top (isolate 0.203): 0,43.18 43.18,43.18 43.18,0 0,0
  pour Bottom (isolate 0.203): 0,43.18 43.18,43.18 43.18,0 0,0
  pour Top (isolate 0.127): 25.4,27.69 25.4,23.11 43.18,23.11 43.18,27.69
N$1  (via drill 0.3)
  Top 0.152: v39.88,15.75 40.22,16.09 R1.2
  Bottom 0.152: PWR\.1 v39.89,15.76 v39.88,15.75
N$2
  Top 0.152: R3.1 13.08,16.76 13.28,16.96 U1.20
N$3
  Top 0.152: R2.1 13.08,19.81 13.73,19.16 U1.18
N$4
  Top 0.152: R4.1 13.08,18.29 13.31,18.06 U1.19
N$5  (via drill 0.3)
  Top 0.152: v18.92,27.81 18.92,28.19 18.16,28.96 R8.2
  Bottom 0.152: I2C.1 19.51,28.4 v18.92,27.81
N$6
  Top 0.152: R6.1 13.08,15.24 13.7,15.86 U1.21
N$7  (via drill 0.3)
  Top 0.152: J3.B5 7.39,10.95 v7.49,11.05 | v6.6,6.48 R12.2
  Bottom 0.152: v7.49,11.05 7.62,10.92 7.62,7.49 v6.6,6.48
N$8  (via drill 0.3)
  Top 0.152: R7.2 18.16,30.48 v19.05,31.37
  Bottom 0.152: I2C.3 19.38,30.02 19.05,30.35 v19.05,31.37
N$9
  Top 0.152: J3.A5 6.71,13.95 7.54,14.78 7.54,18.45 7.07,18.92 R13.2
N$10
  Top 0.152: R1.1 38.52,19.02 LED1.A
N$11
  Top 0.813: U1.6 29.61,18.06 R9.2
N$12
  Top 0.813: R10.2 29,16.51 28.55,16.96 U1.5
N$13
  Bottom 0.508: 3V3.1 J5.3
N$14
  Top 0.152: R11.1 29.5,13.46 28.21,14.76 U1.3
N$15
  Top 0.152: R5.1 28.87,14.99 28,15.86 U1.4
RXD1/PICO  (via drill 0.3)
  Top 0.152: R6.2 9.78,15.24 8.46,16.56 8.46,31.7 12.19,35.43 24.89,35.43 v25.02,35.31
  Bottom 0.152: J8.8 31.78,1.27 35.51,5 35.51,19.02 33.37,21.16 25.75,21.16 24.21,22.7 24.21,35.13 24.38,35.31 v25.02,35.31 26.67,36.96 J7.6
RXD2  (via drill 0.3)
  Top 0.152: R5.2 v32.38,14.99 | v10.06,29.21 9.98,29.28 9.98,30.22 12.48,32.72 21.62,32.72 v22.23,32.11
  Bottom 0.152: J8.4 21.59,4.19 v32.38,14.99 33.73,14.99 34.11,15.37 34.11,18.44 32.79,19.76 25.17,19.76 22.62,22.31 22.62,31.72 v22.23,32.11 | v10.06,29.21 J5.4
SCL/SCK  (via drill 0.3)
  Top 0.152: J2.4 7.39,39.73 v7.37,39.75 | J4.4 11.41,5.08 12.68,3.81 16.51,3.81 v17.78,5.08 | v20.57,5.08 30.48,5.08 J8.9 | R4.2 9.27,18.29 9.02,18.54 9.02,31.47 11.97,34.42 v12.7,34.42 24.77,34.42 v25.02,34.16 | R7.1 13.97,30.48 12.7,31.75 v12.7,32.13
  Bottom 0.152: v17.78,5.08 v20.57,5.08 | v25.02,34.16 24.49,33.63 24.49,22.82 25.86,21.44 33.48,21.44 35.79,19.13 35.79,2.77 J8.9 | v12.7,32.13 v12.7,34.42 12.7,36.83 11.71,37.82 10.31,37.82 8.89,39.24 7.87,39.24 v7.37,39.75 7.87,40.26 8.76,40.26 10.6,38.42 13.02,38.42 13.97,39.37 J7.1
SDA/!CS!  (via drill 0.3)
  Top 0.152: J2.3 v8.39,39.74 v8.38,39.75 | J4.3 9.39,6.09 9.65,6.35 10.54,6.35 12.73,4.16 15.88,4.16 v17.27,5.56 | J8.6 26.67,3.81 25.88,4.6 20.29,4.6 19.91,4.98 v19.91,5.56 | R2.2 9.55,19.81 9.3,20.07 9.3,31.35 11.85,33.91 v14.99,33.91 v23.11,33.91 | R8.1 v14.99,28.96
  Bottom 0.152: v8.38,39.75 8.83,39.75 10.48,38.1 14.99,38.1 | v17.27,5.56 v19.91,5.56 | J8.6 34.95,9.55 34.95,18.79 33.14,20.6 25.52,20.6 23.62,22.49 23.62,33.4 v23.11,33.91 | v14.99,28.96 v14.99,33.91 14.99,38.1 | 14.99,38.1 16.51,39.62 J7.2
SHIELD
  Top 0.406: J3.SHLD2 5.31,8.26 1.38,8.26 J3.SHLD4 | J3.SHLD1 5.31,17.14 1.38,17.14 J3.SHLD3
  Bottom 0.406: J3.SHLD4 SHLD.2 J3.SHLD3
SMA
  Top 0.813: FB1.1 32.3,25.4 32.26,25.44 | C7.1 32.23,25.46 32.26,25.44 | J1.SIG 39.3,25.47 D1.1 33.94,25.47 L1.1 32.26,25.44
TXD1/POCI  (via drill 0.3)
  Top 0.152: R3.2 9.25,16.76 8.74,17.27 8.74,31.58 12.08,34.92 v23.11,34.92
  Bottom 0.152: J8.7 29.22,1.27 35.23,7.28 35.23,18.9 33.25,20.88 25.63,20.88 23.9,22.61 23.9,34.29 23.27,34.92 v23.11,34.92 23.24,34.92 24.13,35.81 J7.5
TXD2  (via drill 0.3)
  Top 0.152: R11.2 v32.38,13.46 | v22.1,32.92 22.02,32.99 12.11,32.99 10.87,31.75 v10.82,31.75
  Bottom 0.152: J8.5 24.13,6.34 31.26,13.46 v32.38,13.46 34.14,13.46 34.39,13.72 34.39,18.55 32.9,20.04 25.28,20.04 22.96,22.36 22.96,32.06 v22.1,32.92 | v10.82,31.75 J5.5
USB_D+  (via drill 0.3)
  Top 0.254: D2.1 7.98,13.2 7.67,13.51 v7.62,13.51 7.55,13.51 6.99,12.95 J3.A6 | J3.B6 5.09,11.95 v5.08,11.94
  Bottom 0.254: v5.08,11.94 5.98,11.94 7.55,13.51 v7.62,13.51
USB_D-
  Top 0.254: D2.3 8.01,12.2 7.87,12.06 7.37,12.06 6.98,12.45 J3.A7 5.33,12.45 5.21,12.57 5.21,13.34 5.33,13.46 6,13.46 J3.B7
VCC_RF
  Top 0.406: R14.2 29.72,21.91 28.37,23.26 U1.9

### Text on the board
Bottom: v10
Milling: Route Out
Measures: Measurements in inches
tDocu: Paul Clark